# Altium schematic sheet Power_Supply.SchDoc
size B; SheetNumber: 16; SheetTotal: 17
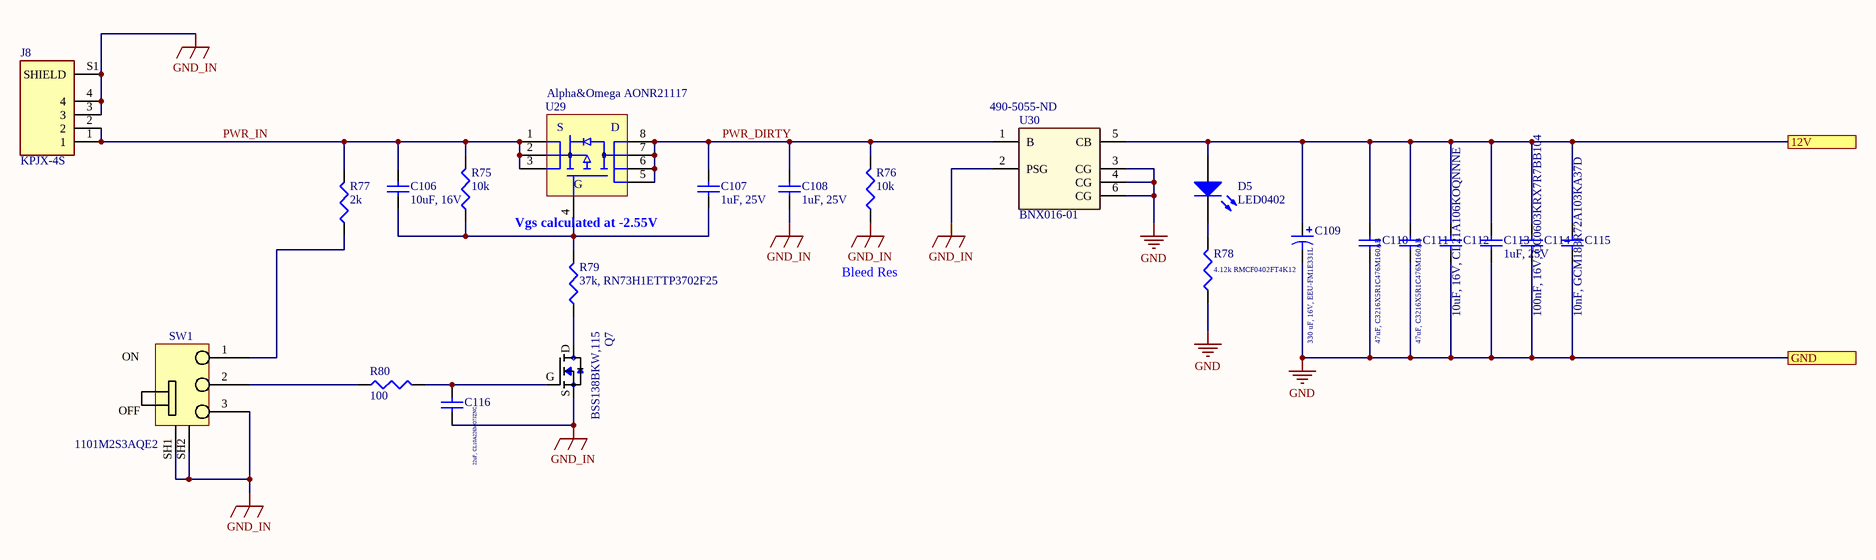
[diagram p0: Power_Supply.SchDoc]

## Parts
C106  10uF, 16V  [SMD-0603]
C107  1uF, 25V  [SMD-0603]
C108  1uF, 25V  [SMD-0603]
C109  330 uF, 16V, EEU-FM1E331L  [CAP-AXIAL-8.0-3.5]
C110  47uF, C3216X5R1C476M160AB  [SMD-1206]
C111  47uF, C3216X5R1C476M160AB  [SMD-1206]
C112  10uF, 16V, CL21A106KOQNNNE  [SMD-0805]
C113  1uF, 25V  [SMD-0603]
C114  100nF, 16V, CC0603KRX7R7BB104  [SMD-0603]
C115  10nF, GCM188R72A103KA37D  [SMD-0603]
C116  22uF, CL10A226MO7JZNC  [SMD-0603]
D5  LED0402  [LED-0402]
J8  KPJX-4S  [KYCON_KPJX-4S]
Q7  BSS138BKW,115  [BSS138BKW,115]
R75  10k  [SMD-0402]
R76  10k  [SMD-0402]
R77  2k  [SMD-0402]
R78  4.12k RMCF0402FT4K12  [SMD-0402]
R79  37k, RN73H1ETTP3702F25  [SMD-0402]
R80  100  [SMD-0402]
SW1  1101M2S3AQE2  [1101M2S3ABE2]
U29  Alpha&Omega AONR21117  [Alpha&Omega_AONR21321]
U30  BNX016-01  Supplier Part Number 1: 490-5055-ND  [FIL_BNX016-01]

## Ports
12V, GND

## Nets
GND: C109.2 C110.1 C111.1 C112.1 C113.1 C114.1 C115.1 R78.1 U30.3(CG) U30.4(CG) U30.6(CG) ; port GND
GND_IN: C108.1 C116.1 J8.3 J8.4 J8.S1(SHIELD) Q7.S R76.1 SW1.3 SW1.SH1 SW1.SH2 U30.2(PSG)
12V: C109.1 C110.2 C111.2 C112.2 C113.2 C114.2 C115.2 D5.2(A) U30.5(CB) ; port 12V
PWR_DIRTY: C107.2 C108.2 R76.2 U29.5 U29.6 U29.7 U29.8 U30.1(B)
PWR_IN: C106.2 J8.1 J8.2 R75.2 R77.2 U29.1 U29.2 U29.3
NetC106_1: C106.1 C107.1 R75.1 R79.2 U29.4
NetC116_2: C116.2 Q7.G R80.2
NetD5_1: D5.1(K) R78.2
NetQ7_D: Q7.D R79.1
NetR77_1: R77.1 SW1.1
NetR80_1: R80.1 SW1.2

## Notes on the sheet
- Vgs calculated at -2.55V
- Bleed Res
- (in symbol 11-1M2S3AQE2) ON; OFF
- (in symbol Alpha&Omega AONR21117) S; D; G

## Library data of the parts
C106 C114-C116 = CAP0603: Ceramic Capacitor 0603
C107 C108 C113 = CAP0603_HV: Ceramic Capacitor 0603, 25V
C109 = CAP_ELECTRO: CAP ALUM 330UF 20% 25V RADIAL EEU-FM1E331
C110 C111 = CAP1206: Ceramic Capacitor 1206 Imperial
C112 = CAP0805: Ceramic Capacitor 0805 Imperial (2012 Metric)
D5 = LED0402: LED 0402
J8 = KPJX-4S: 4 _Power_ Position Circular Connector Jack, Female Sockets Solder; MF: Kycon; Value: *; Package: DIP-20 Kycon; Price: None; MP: KPJX-4S; Availability: Unavailable; SnapEDA_Link: https://www.snapeda.com/parts/KPJX-4S/Kycon/view-part/555404/?ref=snap
Q7 = BSS138: N-Channel Logic Level Enhancement Mode Field Effect Transistor; MF: MICROSS/On Semiconductor; MP: BSS138; Price: None; Availability: Unavailable; Package: TO-236-3 Micross; SnapEDA_Link: https://www.snapeda.com/parts/BSS138/MICROSS/On%20Semiconductor/view-part/?ref=snap; Value: *
R75-R80 = RES0402: Resistor-0402
SW1 = 11-1M2S3AQE2: SPDT, RIGHT ANGLE, PC THRU-HOLE; pin to pad: SH1>4 SH2>5
U29 = Alpha&Omega AONR21117: P-Channel 20-V (D-S) MOSFET
U30 = BNX016-01: Filter: anti-interference; wideband; Mounting: THT; 15A; -40Ã·125Â°; MF: Murata Electronics; MP: BNX016-01; Digi-Key_Purchase_URL: https://www.digikey.com/product-detail/en/murata-electronics/BNX016-01/490-5055-ND/1825576?utm_source=snapeda&utm_medium=aggregator&utm_campaign=symbol; Package: Block-4 Murata; SnapEDA_Link: https://www.snapeda.com/parts/BNX016-01/Murata%20Electronics%20North%20America/view-part/?ref=snap; Digi-Key_Part_Number: 490-5055-ND; Value: *; Supplier 1: Digi-Key